# Altium schematic sheet amp_comp.SchDoc
size 420 x 297 mm; Address1: Address1; Address2: Address2; Address3: Address3; Address4: Address4; DocumentNumber: АБВГ.123456.001 Э3; SheetNumber: 6; SheetTotal: 7; Scale: 1:1; DocumentType: Схема электрическая принципиальная; FirstReferrence: АБВГ.123456.001
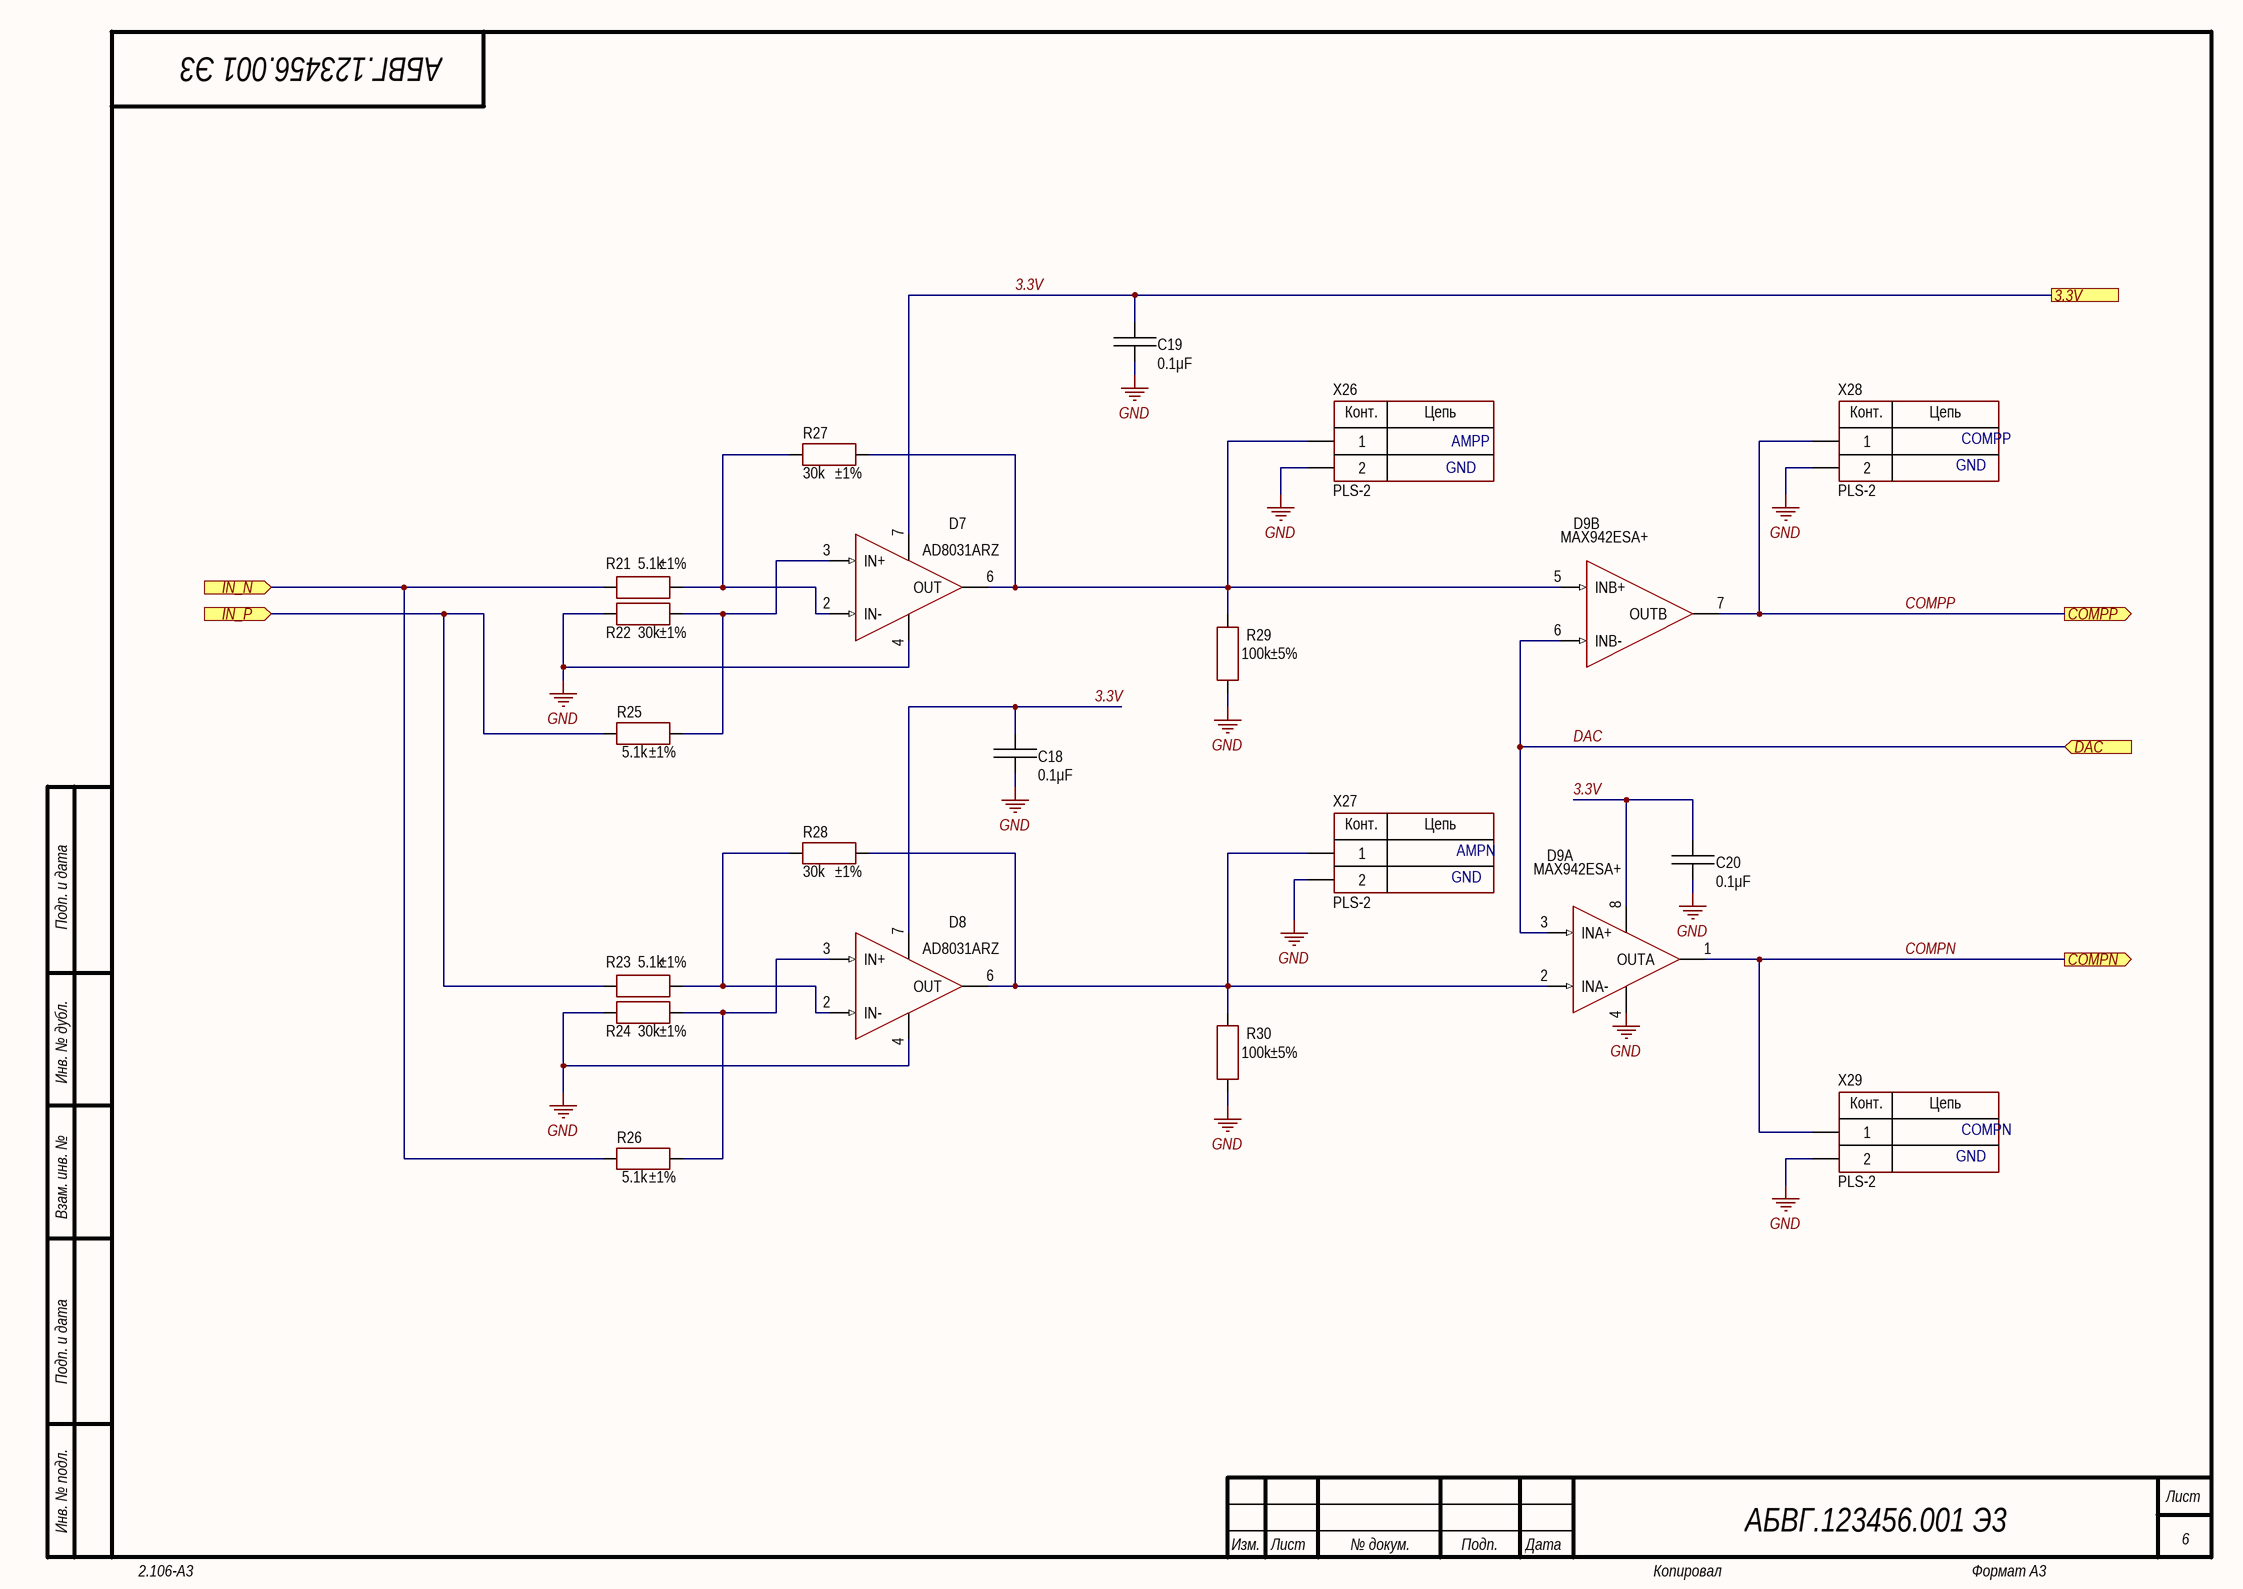
[diagram p0: amp_comp.SchDoc]

## Parts
C18  value 0.1μF  [CAP: 1206]
C19  value 0.1μF  [CAP: 1206]
C20  value 0.1μF  [CAP: 1206]
D7  (no value)  [8-SOIC]
D8  (no value)  [8-SOIC]
D9  PartNumber: MAX942ESA+  [8-SOIC]  (parts A,B of 2)
R21  value 5.1k  Tolerance: ±1%  [RES: 1206]
R22  value 30k  Tolerance: ±1%  [RES: 1206]
R23  value 5.1k  Tolerance: ±1%  [RES: 1206]
R24  value 30k  Tolerance: ±1%  [RES: 1206]
R25  value 5.1k  Tolerance: ±1%  [RES: 1206]
R26  value 5.1k  Tolerance: ±1%  [RES: 1206]
R27  value 30k  Tolerance: ±1%  [RES: 1206]
R28  value 30k  Tolerance: ±1%  [RES: 1206]
R29  value 100k  Tolerance: ±5%  [RES: 1206]
R30  value 100k  Tolerance: ±5%  [RES: 1206]
X26  (no value)  [CON: PLS-2]
X27  (no value)  [CON: PLS-2]
X28  (no value)  [CON: PLS-2]
X29  (no value)  [CON: PLS-2]

## Ports
3.3V, COMPN (out), COMPP (out), DAC (in), IN_N (in), IN_P (in)

## Nets
GND: C18.1 C19.1 C20.1 D7.4(V-) D8.4(V-) D9.4(GND) R22.2 R24.2 R29.1 R30.1 X26.2 X27.2 X28.2 X29.2
3.3V: C18.2 C19.2 C20.2 D7.7(V+) D8.7(V+) D9.8(V+) ; port 3.3V
COMPN: D9.1(OUTA) X29.1 ; port COMPN
COMPP: D9.7(OUTB) X28.1 ; port COMPP
DAC: D9.3(INA+) D9.6(INB-) ; port DAC
IN_N: R21.2 R26.2 ; port IN_N
IN_P: R23.2 R25.2 ; port IN_P
NetD7_2: D7.2(IN-) R21.1 R27.2
NetD7_3: D7.3(IN+) R22.1 R25.1
NetD7_6: D7.6(OUT) D9.5(INB+) R27.1 R29.2 X26.1
NetD8_2: D8.2(IN-) R23.1 R28.2
NetD8_3: D8.3(IN+) R24.1 R26.1
NetD8_6: D8.6(OUT) D9.2(INA-) R28.1 R30.2 X27.1

## Notes on the sheet
- AMPP
- COMPP
- GND
- AMPN
- COMPN
- Подп. и дата
- Инв. № дубл.
- Взам. инв. №
- Инв. № подл.
- Изм.
- Лист
- № докум.
- Подп.
- Дата
- 2.106-A3
- Копировал
- Формат А3
- (in symbol PLS-2) Конт.; Цепь

## Library data of the parts
C18-C20 = Ceramic_1206: Manufacturer: Murata Electronics; PartNumber: GRM319R71H104K; ValueManufacturerPartNumber: Ceramic capacitor, 0.1μF, X7R, ±10%, 50V, 1206, -55...+125°C; TypeCapacitor: Ceramic capacitor; Tolerance: ±10%; TypeDielectric: X7R; Voltage: 50V; Package: 1206; HelpURL: https://www.chipdip.ru/product/grm319r71h104k; Temperature: -55...+125°C
D7 D8 = AD8031ARZ: OP amplifier; Manufacturer: Analog Devices Inc.; ValueManufacturerPartNumber: IC op amplifier, Rail-to-Rail, 80MHz, 2.7V ~ 12V, ±1.35V ~ 6V, -40°C ~ 85°C, 8-SOIC; Supply: 2.7V ~ 12V, ±1.35V ~ 6V; OutputType: Rail-to-Rail; GainBandwidth: 80MHz; Slew Rate: 35V/µs; HelpURL: https://www.digikey.com/en/products/detail/analog-devices-inc/AD8031ARZ/620544; Package: 8-SOIC; ComponentType: IC op amplifier; Temperature: -40°C ~ 85°C; PartNumber: AD8031ARZ
D9 = MAX942ExA+: Comparator; Manufacturer: Maxim Integrated Products; ValueManufacturerPartNumber: IC comparator, Rail-to-Rail, 2.7…6V, -40…85°C, DIP-8(P)/SOIC-8(S); Supply: 2.7…6V; OutputType: Rail-to-Rail; Propagation Delay: 80ns; HelpURL: https://www.chipdip.ru/search?searchtext=MAX942; Package: DIP-8(P)/SOIC-8(S); ComponentType: IC comparator; Temperature: -40…85°C
R21 R23 R25 R26 = Resistor_1206: Manufacturer: Yageo; PartNumber: RC1206JR-07100RL; ValueManufacturerPartNumber: Resistor film, 5.1k, ±1%, 1206, 0.25W, -55...+125°C; TypeResistor: Resistor film; Power: 0.25W; Package: 1206; HelpURL: https://www.digikey.com/product-detail/en/yageo/RC1206JR-07100RL/311-100ERCT-ND/732153; Temperature: -55...+125°C
R22 R24 R27 R28 = Resistor_1206: Manufacturer: Yageo; PartNumber: RC1206JR-07100RL; ValueManufacturerPartNumber: Resistor film, 30k, ±1%, 1206, 0.25W, -55...+125°C; TypeResistor: Resistor film; Power: 0.25W; Package: 1206; HelpURL: https://www.digikey.com/product-detail/en/yageo/RC1206JR-07100RL/311-100ERCT-ND/732153; Temperature: -55...+125°C
R29 R30 = Resistor_1206: Manufacturer: Yageo; PartNumber: RC1206JR-07100RL; ValueManufacturerPartNumber: Resistor film, 100k, ±5%, 1206, 0.25W, -55...+125°C; TypeResistor: Resistor film; Power: 0.25W; Package: 1206; HelpURL: https://www.digikey.com/product-detail/en/yageo/RC1206JR-07100RL/311-100ERCT-ND/732153; Temperature: -55...+125°C
X26-X29 = PLS-2: Manufacturer: Connfly; ValueManufacturerPartNumber: Connector, 2pin, 2.54mm, 500VAC, 3A; TypeConnector: Connector; VoltageMax: 500VAC; Pitch: 2.54mm; CurrentMax: 3A; Multichannel: 2pin; HelpURL: https://www.chipdip.ru/product/pls-2; PartNumber: PLS-2; CommentText: PLS-2